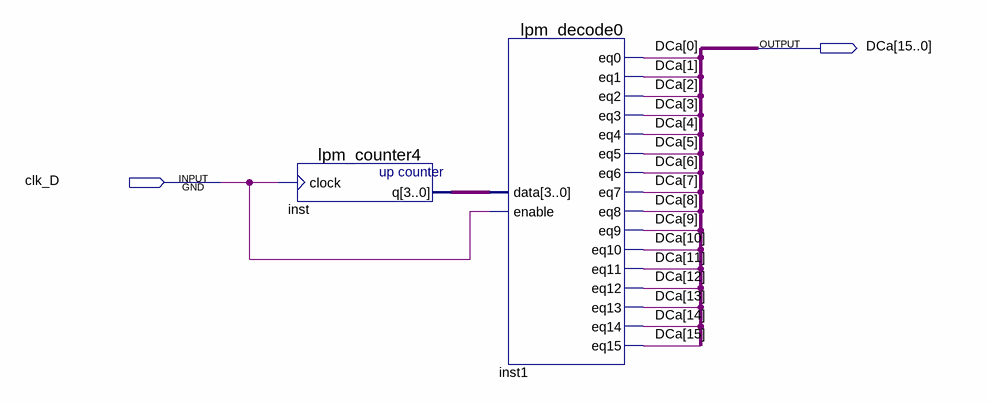
[diagram p0: schematic sheet]
// Quartus schematic block3.bdf as structural Verilog: 2 symbols, 2 pins
module block3 (
  input  clk_D,
  output [15:0] DCa
);

  wire [3:0] inst_q;

  lpm_counter4 inst (.clock(clk_D), .q(inst_q));
  lpm_decode0 inst1 (
    .data(inst_q), .enable(clk_D), .eq0(DCa[0]), .eq1(DCa[1]), .eq2(DCa[2]), .eq3(DCa[3]), .eq4(DCa[4]),
    .eq5(DCa[5]), .eq6(DCa[6]), .eq7(DCa[7]), .eq8(DCa[8]), .eq9(DCa[9]), .eq10(DCa[10]), .eq11(DCa[11]),
    .eq12(DCa[12]), .eq13(DCa[13]), .eq14(DCa[14]), .eq15(DCa[15]));
endmodule
